# EAGLE schematic Arduino-HC05 (EAGLE 6.5.0)
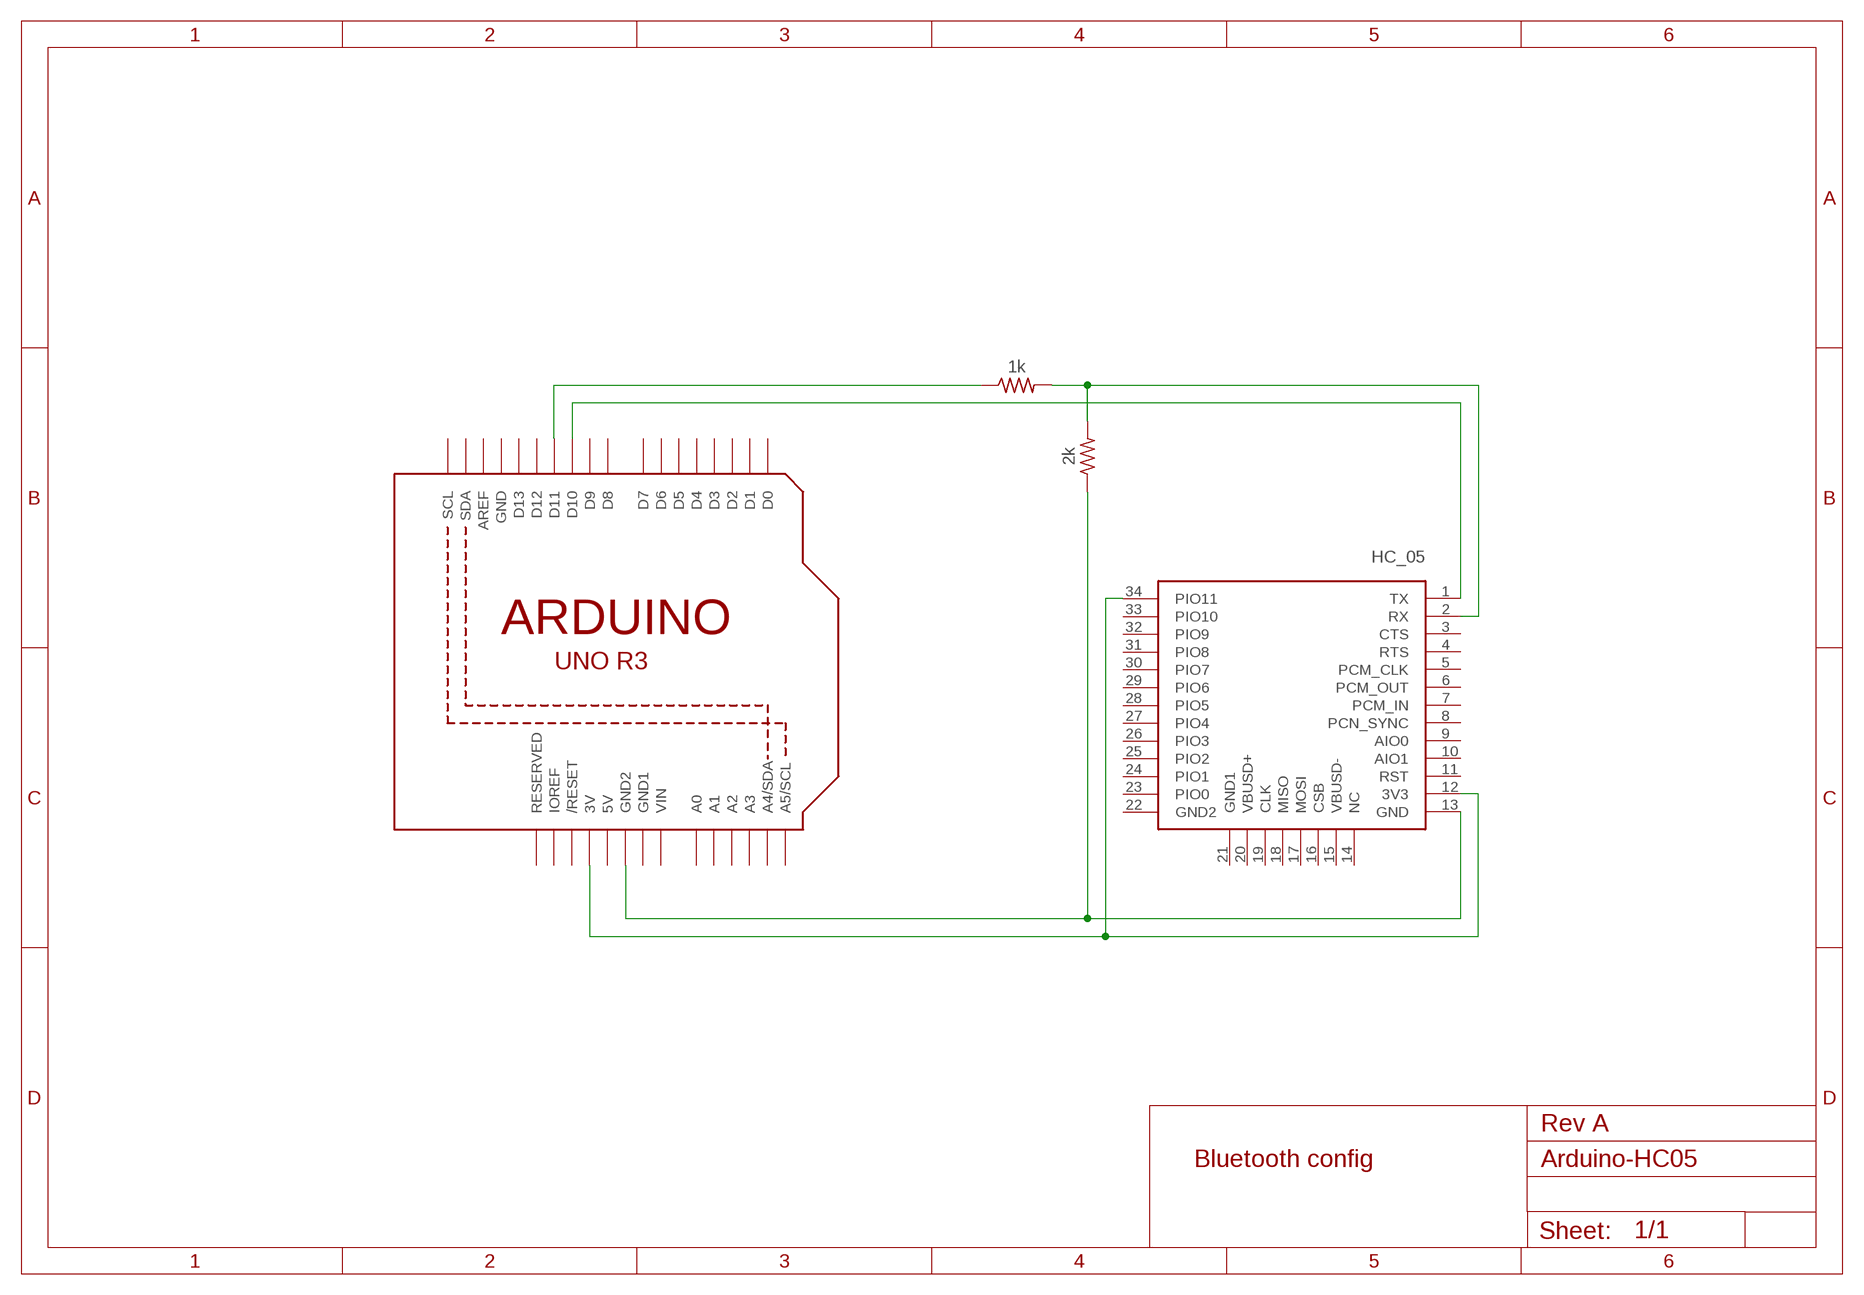
[diagram p0: schematic, sheet 1]

## Parts
R1  1k  R-US_0207/15  [0207/15]
R2  2k  R-US_0207/15  [0207/15]
U1  ARDUINOR3-BPLACE  [ARDUINOR3-BPLACE]
U2  HC_05  [BLUETOOTH_SMD]

## Nets
N$1: R2.1 U1.GND2 U2.13(GND)
N$2: U1.3V U2.12(3V3) U2.34(PIO11)
N$3: U1.D10 U2.1(TX)
N$4: R1.2 R2.2 U2.2(RX)
N$6: R1.1 U1.D11
Unconnected: U1.A0 U1.A1 U1.A2 U1.A3 U1.A4(A4/SDA) U1.A5(A5/SCL) U1.AREF U1.D0 U1.D1 U1.D2 U1.D3 U1.D4 U1.D5 U1.D6 U1.D7 U1.D8 U1.D9 U1.D12 U1.D13 U1.IOREF U1.RESERVED U1.RESET(/RESET) U1.SCL U1.SDA U2.3(CTS) U2.4(RTS) U2.5(PCM_CLK) U2.6(PCM_OUT) U2.7(PCM_IN) U2.8(PCN_SYNC) U2.9(AIO0) U2.10(AIO1) U2.11(RST) U2.14(NC) U2.15(VBUSD-) U2.16(CSB) U2.17(MOSI) U2.18(MISO) U2.19(CLK) U2.20(VBUSD+) U2.21(GND1) U2.22(GND2) U2.23(PIO0) U2.24(PIO1) U2.25(PIO2) U2.26(PIO3) U2.27(PIO4) U2.28(PIO5) U2.29(PIO6) U2.30(PIO7) U2.31(PIO8) U2.32(PIO9) U2.33(PIO10)

## Notes on the sheet
- Rev A
- Bluetooth config

## Power pins joined to a net without a drawn wire
5V: U1.5V
GND: U1.GND
GND1: U1.GND1
VIN: U1.VIN

## Library data of the parts
R1 R2 = rcl:R-US_: RESISTOR, American symbol
U1 = adafruit:ARDUINOR3: This is a new object for the new Arduino R3 - with extra pins that you may want to use (such as IOref, and duplicated A4/A5
U2 = holter:HC_05: HC-05 Bluetooth Module